# Altium project 远程温度检测器.PrjPCB
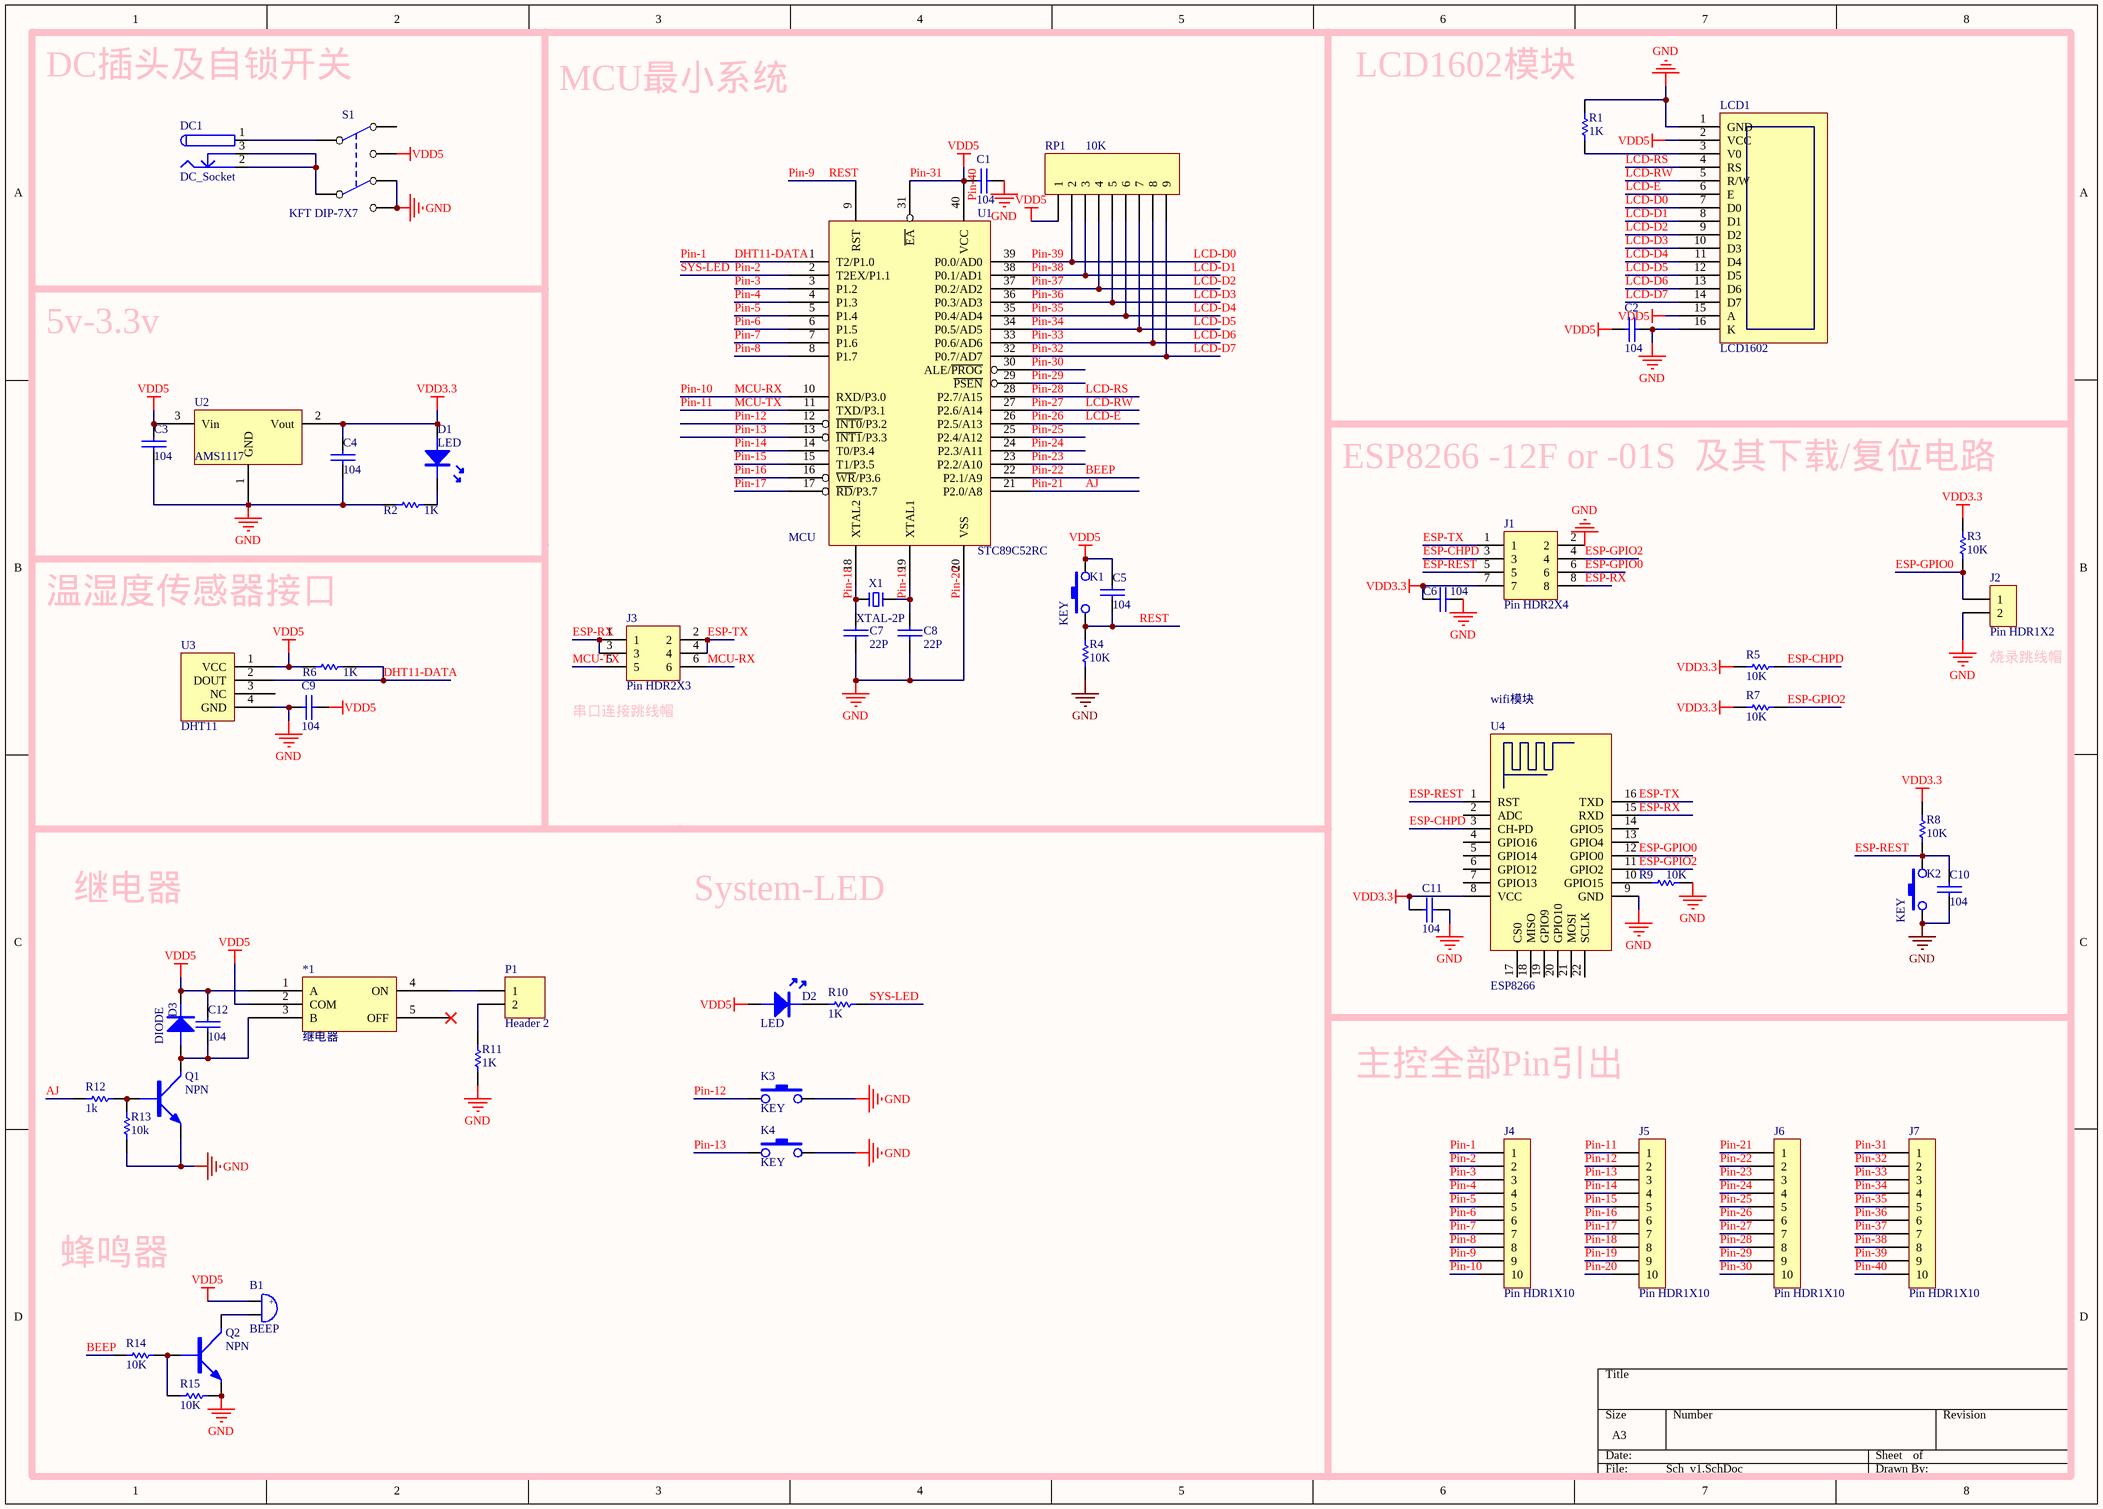
[diagram p0: Sch_v1.SchDoc]
1 sheet, 55 parts. Net scope: global (net labels, ports and power ports of the same name join across sheets).
Board files: PCB1.PcbDoc, PCB_v1.PcbDoc

## Sheet Sch_v1.SchDoc
size A3

### Parts
*1  继电器  [继电器]
B1  BEEP  [BEEP 6.5x12x8.5]
C1  104  [0805C]
C2  104  [0805C]
C3  104  [0805C]
C4  104  [0805C]
C5  104  [0805C]
C6  104  [0805C]
C7  22P  [0805C]
C8  22P  [0805C]
C9  104  [0805C]
C10  104  [0805C]
C11  104  [0805C]
C12  104  [0805C]
D1  LED  [LED-0805R]
D2  LED  [LED-0805R]
D3  DIODE  [LL34]
DC1  DC_Socket  [DC-005]
J1  Pin HDR2X4  [Pin HDR2X4/2.54mm-S]
J2  Pin HDR1X2  [Pin HDR1X2/2.54mm-S]
J3  Pin HDR2X3  [Pin HDR2X3/2.54mm-S]
J4  Pin HDR1X10  [Pin HDR1X10/2.54mm-S]
J5  Pin HDR1X10  [Pin HDR1X10/2.54mm-S]
J6  Pin HDR1X10  [Pin HDR1X10/2.54mm-S]
J7  Pin HDR1X10  [Pin HDR1X10/2.54mm-S]
K1  KEY  [SMD-3X6X2.5]
K2  KEY  [SMD-3X6X2.5]
K3  KEY  [SMD-3X6X2.5]
K4  KEY  [SMD-3X6X2.5]
LCD1  LCD1602  [Fe-HDR1X16/2.54-S]
P1  Header 2  [HDR1X2]
Q1  NPN  [SOT-23]
Q2  NPN  [SOT-23]
R1  1K  [0805R]
R2  1K  [0805R]
R3  10K  [0805R]
R4  10K  [0805R]
R5  10K  [0805R]
R6  1K  [0805R]
R7  10K  [0805R]
R8  10K  [0805R]
R9  10K  [0805R]
R10  1K  [0805R]
R11  1K  [0805R]
R12  1k  [0805R]
R13  10k  [0805R]
R14  10K  [0805R]
R15  10K  [0805R]
RP1  10K  [HDR1X9]
S1  KFT DIP-7X7  [KFT DIP-8X8]
U1  STC89C52RC  [DIP40]
U2  AMS1117  [SOT223]
U3  DHT11  [Fe-HDR1X4/2.54-S]
U4  ESP8266  [WIFIM-SMD_ESP-12F-ESP8266MOD]
X1  XTAL-2P  [OSC HC-49S]

### Nets
Pin-20: C1.1 C2.1 C3.1 C4.1 C6.1 C7.1 C8.1 C9.2 C10.1 C11.1 J1.2 J2.2 J5.10 K2.1 K3.3 K4.3 LCD1.1(GND) LCD1.16(K) Q1.E Q2.E R1.1 R2.2 R4.1 R9.1 R11.2 R13.1 R15.1 S1.4 S1.6 U1.20(VSS) U2.1(GND) U3.4(GND) U4.9(GND)  [also labelled GND]
Pin-31: *1.1(A) *1.2(COM) B1.1 C1.2 C2.2 C3.2 C5.2 C9.1 C12.2 D2.A D3.K J7.1 J7.10 K1.3 LCD1.2(VCC) LCD1.15(A) R6.2 RP1.1 S1.1 U1.31(~{EA}) U1.40(VCC) U2.3(Vin) U3.1(VCC)  [also labelled Pin-40, VDD5]
VDD3.3: C4.2 C6.2 C11.2 D1.A J1.7 R3.2 R5.1 R7.1 R8.2 U2.2(Vout) U4.8(VCC)
AJ: J6.1 R12.2 U1.21(P2.0/A8)  [also labelled Pin-21]
BEEP: J6.2 R14.2 U1.22(P2.1/A9)  [also labelled Pin-22]
DHT11-DATA: J4.1 R6.1 U1.1(T2/P1.0) U3.2(DOUT)  [also labelled Pin-1]
ESP-CHPD: J1.3 R5.2 U4.3(CH-PD)
ESP-GPIO0: J1.6 J2.1 R3.1 U4.12(GPIO0)
ESP-GPIO2: J1.4 R7.2 U4.11(GPIO2)
ESP-REST: C10.2 J1.5 K2.3 R8.1 U4.1(RST)
ESP-RX: J1.8 J3.1 J3.3 U4.15(RXD)
ESP-TX: J1.1 J3.2 J3.4 U4.16(TXD)
LCD-D0: J7.9 LCD1.7(D0) RP1.2 U1.39(P0.0/AD0)  [also labelled Pin-39]
LCD-D1: J7.8 LCD1.8(D1) RP1.3 U1.38(P0.1/AD1)  [also labelled Pin-38]
LCD-D2: J7.7 LCD1.9(D2) RP1.4 U1.37(P0.2/AD2)  [also labelled Pin-37]
LCD-D3: J7.6 LCD1.10(D3) RP1.5 U1.36(P0.3/AD3)  [also labelled Pin-36]
LCD-D4: J7.5 LCD1.11(D4) RP1.6 U1.35(P0.4/AD4)  [also labelled Pin-35]
LCD-D5: J7.4 LCD1.12(D5) RP1.7 U1.34(P0.5/AD5)  [also labelled Pin-34]
LCD-D6: J7.3 LCD1.13(D6) RP1.8 U1.33(P0.6/AD6)  [also labelled Pin-33]
LCD-D7: J7.2 LCD1.14(D7) RP1.9 U1.32(P0.7/AD7)  [also labelled Pin-32]
LCD-E: J6.6 LCD1.6(E) U1.26(P2.5/A13)  [also labelled Pin-26]
LCD-RS: J6.8 LCD1.4(RS) U1.28(P2.7/A15)  [also labelled Pin-28]
LCD-RW: J6.7 LCD1.5(R/W) U1.27(P2.6/A14)  [also labelled Pin-27]
MCU-RX: J3.6 J4.10 U1.10(RXD/P3.0)  [also labelled Pin-10]
MCU-TX: J3.5 J5.1 U1.11(TXD/P3.1)  [also labelled Pin-11]
Pin-2: J4.2 R10.2 U1.2(T2EX/P1.1)  [also labelled SYS-LED]
Pin-3: J4.3 U1.3(P1.2)
Pin-4: J4.4 U1.4(P1.3)
Pin-5: J4.5 U1.5(P1.4)
Pin-6: J4.6 U1.6(P1.5)
Pin-7: J4.7 U1.7(P1.6)
Pin-8: J4.8 U1.8(P1.7)
Pin-9: C5.1 J4.9 K1.1 R4.2 U1.9(RST)  [also labelled REST]
Pin-12: J5.2 K3.1 U1.12(~{INT0}/P3.2)
Pin-13: J5.3 K4.1 U1.13(~{INT1}/P3.3)
Pin-14: J5.4 U1.14(T0/P3.4)
Pin-15: J5.5 U1.15(T1/P3.5)
Pin-16: J5.6 U1.16(~{WR}/P3.6)
Pin-17: J5.7 U1.17(~{RD}/P3.7)
Pin-18: C7.2 J5.8 U1.18(XTAL2) X1.1
Pin-19: C8.2 J5.9 U1.19(XTAL1) X1.2
Pin-23: J6.3 U1.23(P2.2/A10)
Pin-24: J6.4 U1.24(P2.3/A11)
Pin-25: J6.5 U1.25(P2.4/A12)
Pin-29: J6.9 U1.29(~{PSEN})
Pin-30: J6.10 U1.30(ALE/~{PROG})
Net*1_3: *1.3(B) C12.1 D3.A Q1.C
Net*1_4: *1.4(ON) P1.1
NetB1_2: B1.2 Q2.C
NetD1_K: D1.K R2.1
NetD2_K: D2.K R10.1
NetDC1_1: DC1.1 S1.2
NetDC1_2: DC1.2 DC1.3 S1.5
NetLCD1_3: LCD1.3(V0) R1.2
NetP1_2: P1.2 R11.1
NetQ1_B: Q1.B R12.1 R13.2
NetQ2_B: Q2.B R14.1 R15.2
NetR9_2: R9.2 U4.10(GPIO15)

Not connected (* = marked no-connect by the designer): *1 5(OFF)*; S1 3; U3 3(NC); U4 2(ADC) 4(GPIO16) 5(GPIO14) 6(GPIO12) 7(GPIO13) 13(GPIO4) 14(GPIO5) 17(CS0) 18(MISO) 19(GPIO9) 20(GPIO10) 21(MOSI) 22(SCLK)

### Notes on the sheet
- DC插头及自锁开关
- MCU最小系统
- LCD1602模块
- 5v-3.3v
- ESP8266 -12F or -01S  及其下载/复位电路
- (near U1) MCU
- 温湿度传感器接口
- (near J3) 串口连接跳线帽
- wifi模块
- (near J2) 烧录跳线帽
- 继电器
- System-LED
- 主控全部Pin引出
- 蜂鸣器
- (in symbol BEEP) +

### Library data of the parts
B1 = BEEP: 蜂鸣器
C1-C12 = CAP: 无极性电容
D3 = DIODE: 普通二极管
P1 = Header 2: Header, 2-Pin; LatestRevisionDate: 17-Jul-2002; LatestRevisionNote: Re-released for DXP Platform.; Publisher: Altium Limited
Q1 Q2 = NPN: NPN三极管
R1-R15 = RES
RP1 = Header 9: Header, 9-Pin; LatestRevisionDate: 17-Jul-2002; LatestRevisionNote: Re-released for DXP Platform.; Publisher: Altium Limited
U2 = AMS1117: 三端稳压芯片
X1 = XTAL-2P: 2脚无源脚晶振